# EAGLE design amp (EAGLE 5.07)
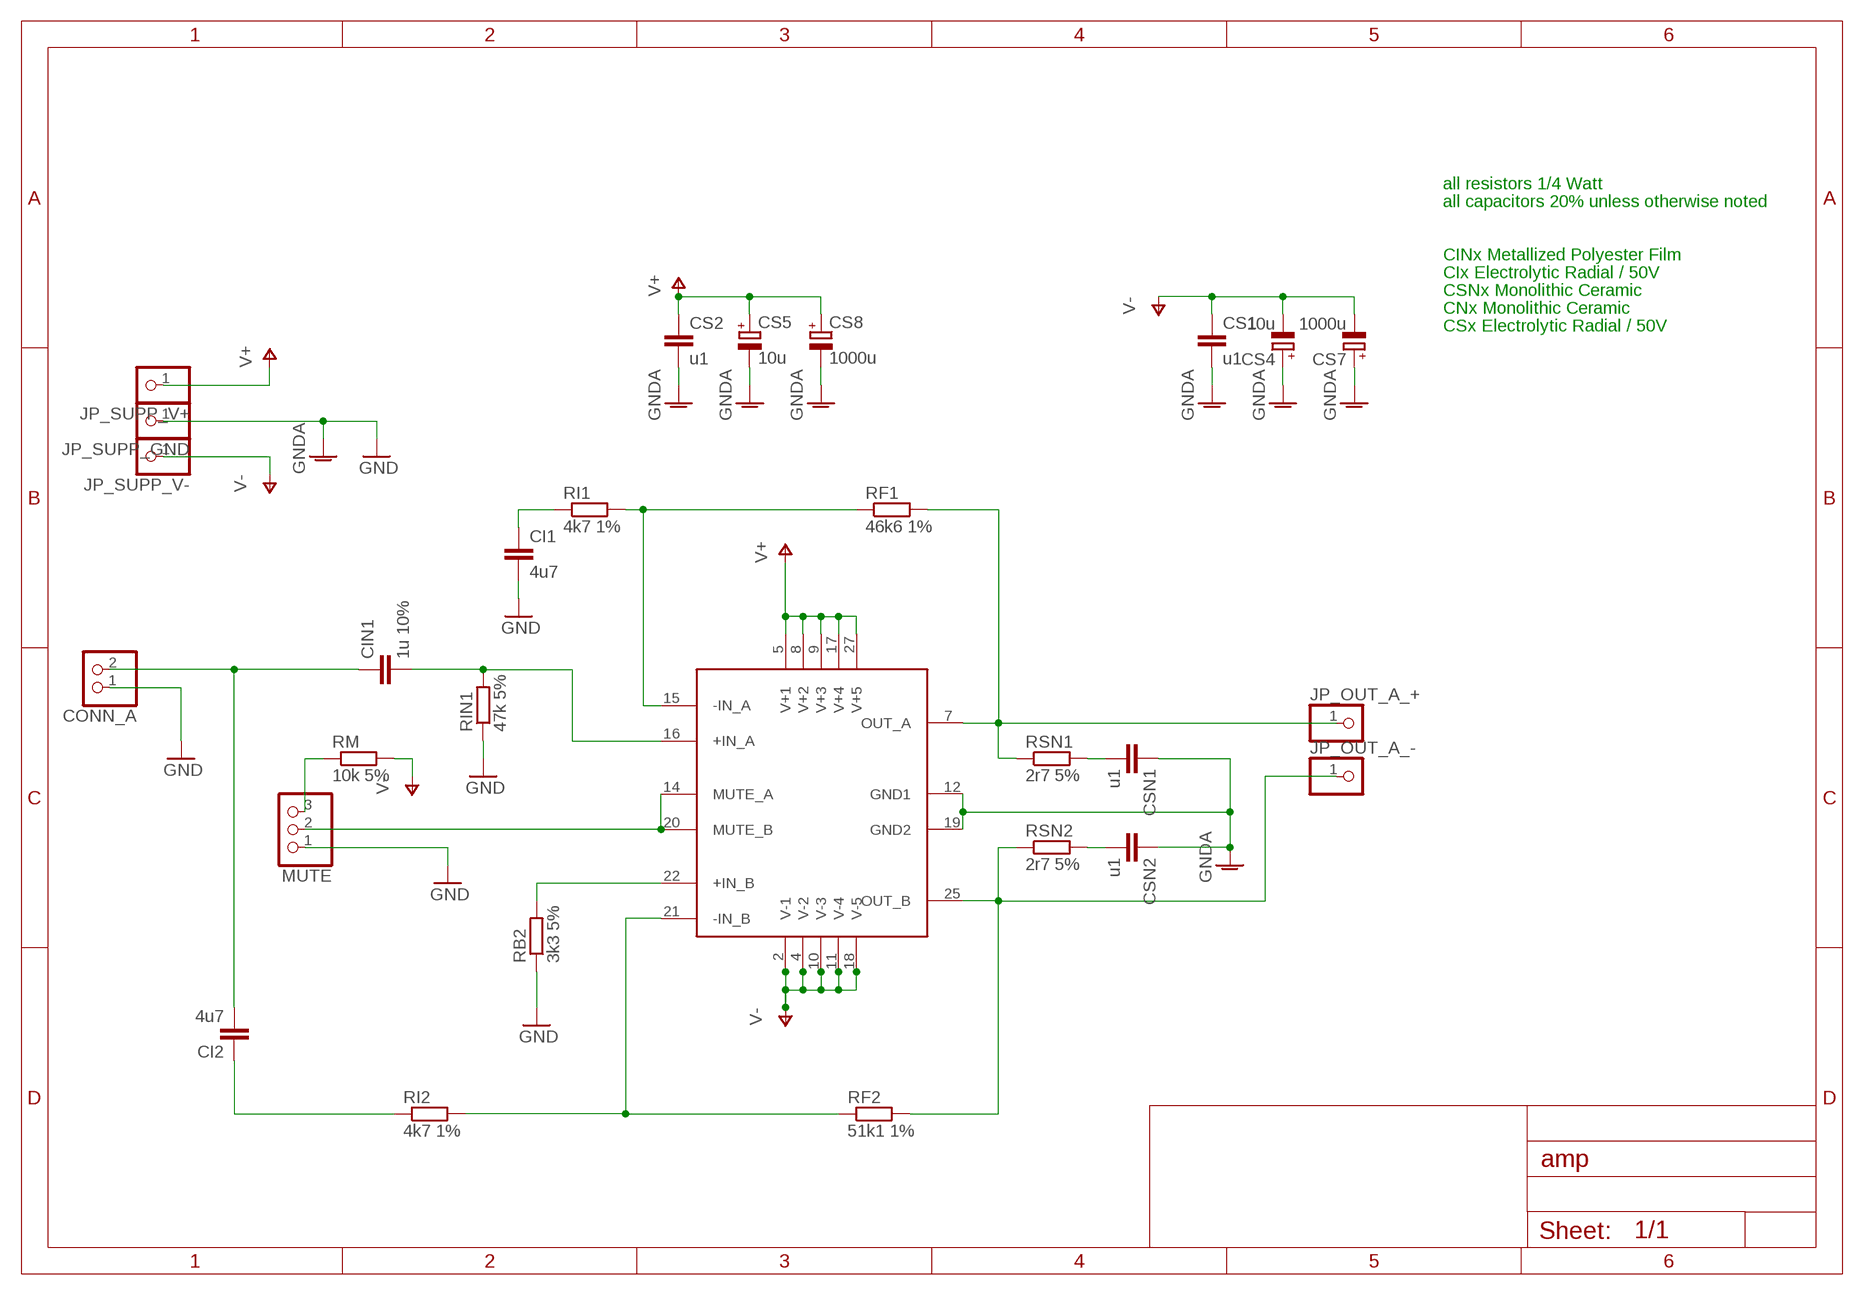
[diagram p0: schematic, sheet 1]

## Parts
CI1  4u7  C-EU050-050X075  [C050-050X075]
CI2  4u7  C-EU050-050X075  [C050-050X075]
CIN1  1u 10%  C-EU050-025X075  [C050-025X075]
CONN_A  PINHD-1X2  [1X02]
CS1  u1  C-EU050-025X075  [C050-025X075]
CS2  u1  C-EU050-025X075  [C050-025X075]
CS4  10u  CPOL-EUE2-5  [E2-5]
CS5  10u  CPOL-EUE2-5  [E2-5]
CS7  1000u  CPOL-EUE7.5-16  [E7,5-16]
CS8  1000u  CPOL-EUE7.5-16  [E7,5-16]
CSN1  u1  C-EU025-030X050  [C025-030X050]
CSN2  u1  C-EU025-030X050  [C025-030X050]
JP_OUT_A_+  PINHD-1X1  [1X01]
JP_OUT_A_-  PINHD-1X1  [1X01]
JP_SUPP_GND  PINHD-1X1  [1X01]
JP_SUPP_V+  PINHD-1X1  [1X01]
JP_SUPP_V-  PINHD-1X1  [1X01]
MUTE  PINHD-1X3  [1X03]
RB2  3k3 5%  R-EU_0204/7  [0204/7]
RF1  46k6 1%  R-EU_0204/5  [0204/5]
RF2  51k1 1%  R-EU_0204/5  [0204/5]
RI1  4k7 1%  R-EU_0204/5  [0204/5]
RI2  4k7 1%  R-EU_0204/5  [0204/5]
RIN1  47k 5%  R-EU_0207/7  [0207/7]
RM  10k 5%  R-EU_0204/5  [0204/5]
RSN1  2r7 5%  R-EU_0204/5  [0204/5]
RSN2  2r7 5%  R-EU_0204/5  [0204/5]
U$1  L4780TA  LM4780TA  [TO-220_27]

## Nets
+INA [audio_in]: CIN1.2 RIN1.2 U$1.16(+IN_A)
+INB [audio_in]: RB2.2 U$1.22(+IN_B)
-INA: RF1.1 RI1.2 U$1.15(-IN_A)
-INB: RF2.1 RI2.2 U$1.21(-IN_B)
GND [power]: CI1.2 CONN_A.1 CS1.2 CS2.2 CS4.+ CS5.- CS7.+ CS8.- CSN1.1 CSN2.1 JP_SUPP_GND.1 MUTE.1 RB2.1 RIN1.1 U$1.12(GND1) U$1.19(GND2) ; supply symbol labelled GNDA
N$4 [power]: MUTE.3 RM.1
N$6 [low_gnd]: CI2.2 CIN1.1 CONN_A.2
N$9: CSN1.2 RSN1.2
N$11: CI2.1 RI2.1
N$14: CSN2.2 RSN2.2
N$17: CI1.1 RI1.1
N_MUTE: MUTE.2 U$1.14(MUTE_A) U$1.20(MUTE_B)
N_OUT_A [audio_out]: JP_OUT_A_+.1 RF1.2 RSN1.1 U$1.7(OUT_A)
N_OUT_B [audio_out]: JP_OUT_A_-.1 RF2.2 RSN2.1 U$1.25(OUT_B)
V+ [power]: CS2.1 CS5.+ CS8.+ JP_SUPP_V+.1 U$1.5(V+1) U$1.8(V+2) U$1.9(V+3) U$1.17(V+4) U$1.27(V+5)
V- [power]: CS1.1 CS4.- CS7.- JP_SUPP_V-.1 RM.2 U$1.2(V-1) U$1.4(V-2) U$1.10(V-3) U$1.11(V-4) U$1.18(V-5)

## Notes on the sheet
- all resistors 1/4 Watt
- all capacitors 20% unless otherwise noted
- CINx Metallized Polyester Film
- CIx Electrolytic Radial / 50V
- CSNx Monolithic Ceramic
- CNx Monolithic Ceramic
- CSx Electrolytic Radial / 50V

## Library data of the parts
CI1 CI2 CIN1 CS1 CS2 CSN1 CSN2 = resistor:C-EU: CAPACITOR, European symbol
CONN_A = pinhead:PINHD-1X2: PIN HEADER
CS4 CS5 CS7 CS8 = resistor:CPOL-EU: POLARIZED CAPACITOR, European symbol
JP_OUT_A_+ JP_OUT_A_- JP_SUPP_GND JP_SUPP_V+ JP_SUPP_V- = pinhead:PINHD-1X1: PIN HEADER
MUTE = pinhead:PINHD-1X3: PIN HEADER
RB2 RF1 RF2 RI1 RI2 RIN1 RM RSN1 RSN2 = resistor:R-EU_: RESISTOR, European symbol
U$1 = mru-lib:LM4780TA: National Semiconductor LM4780 Overture Audio Power Amplifier Series TO220 27 Lead Package

## Net classes
1 power: width 1.778 mm
2 audio_in: width 0.508 mm
3 audio_out: width 1.27 mm

## Board
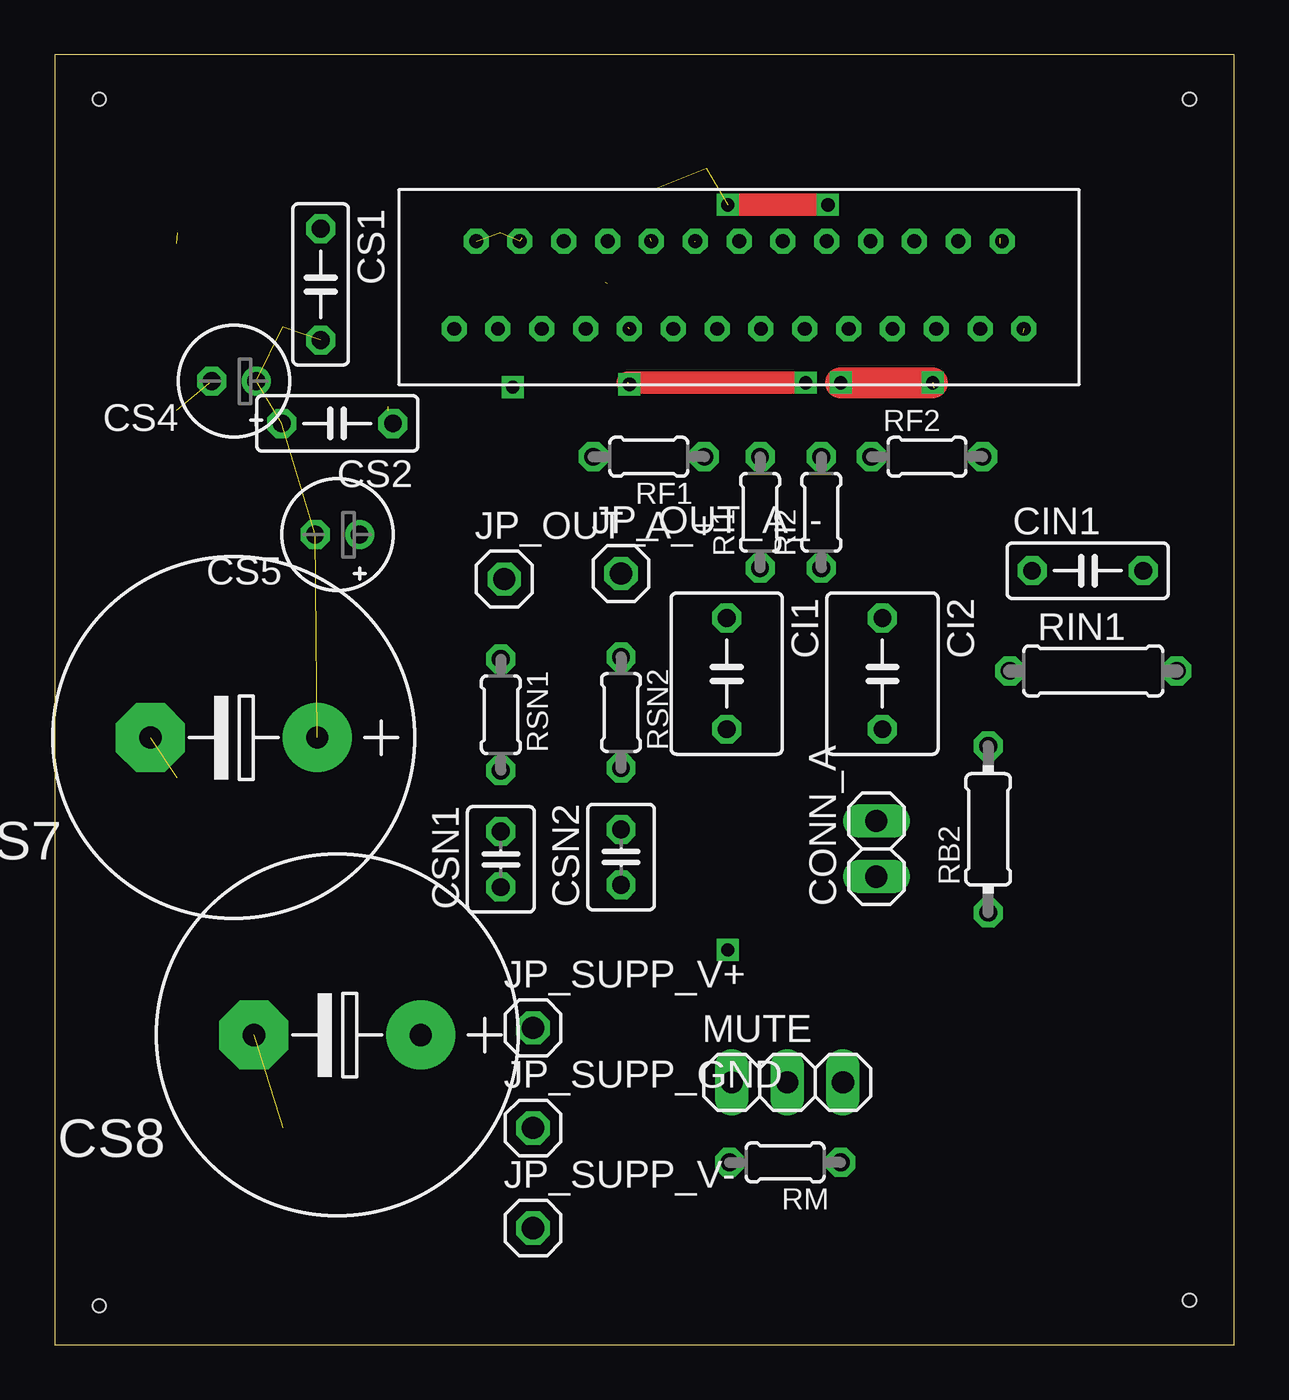
[diagram p1: board, top side]
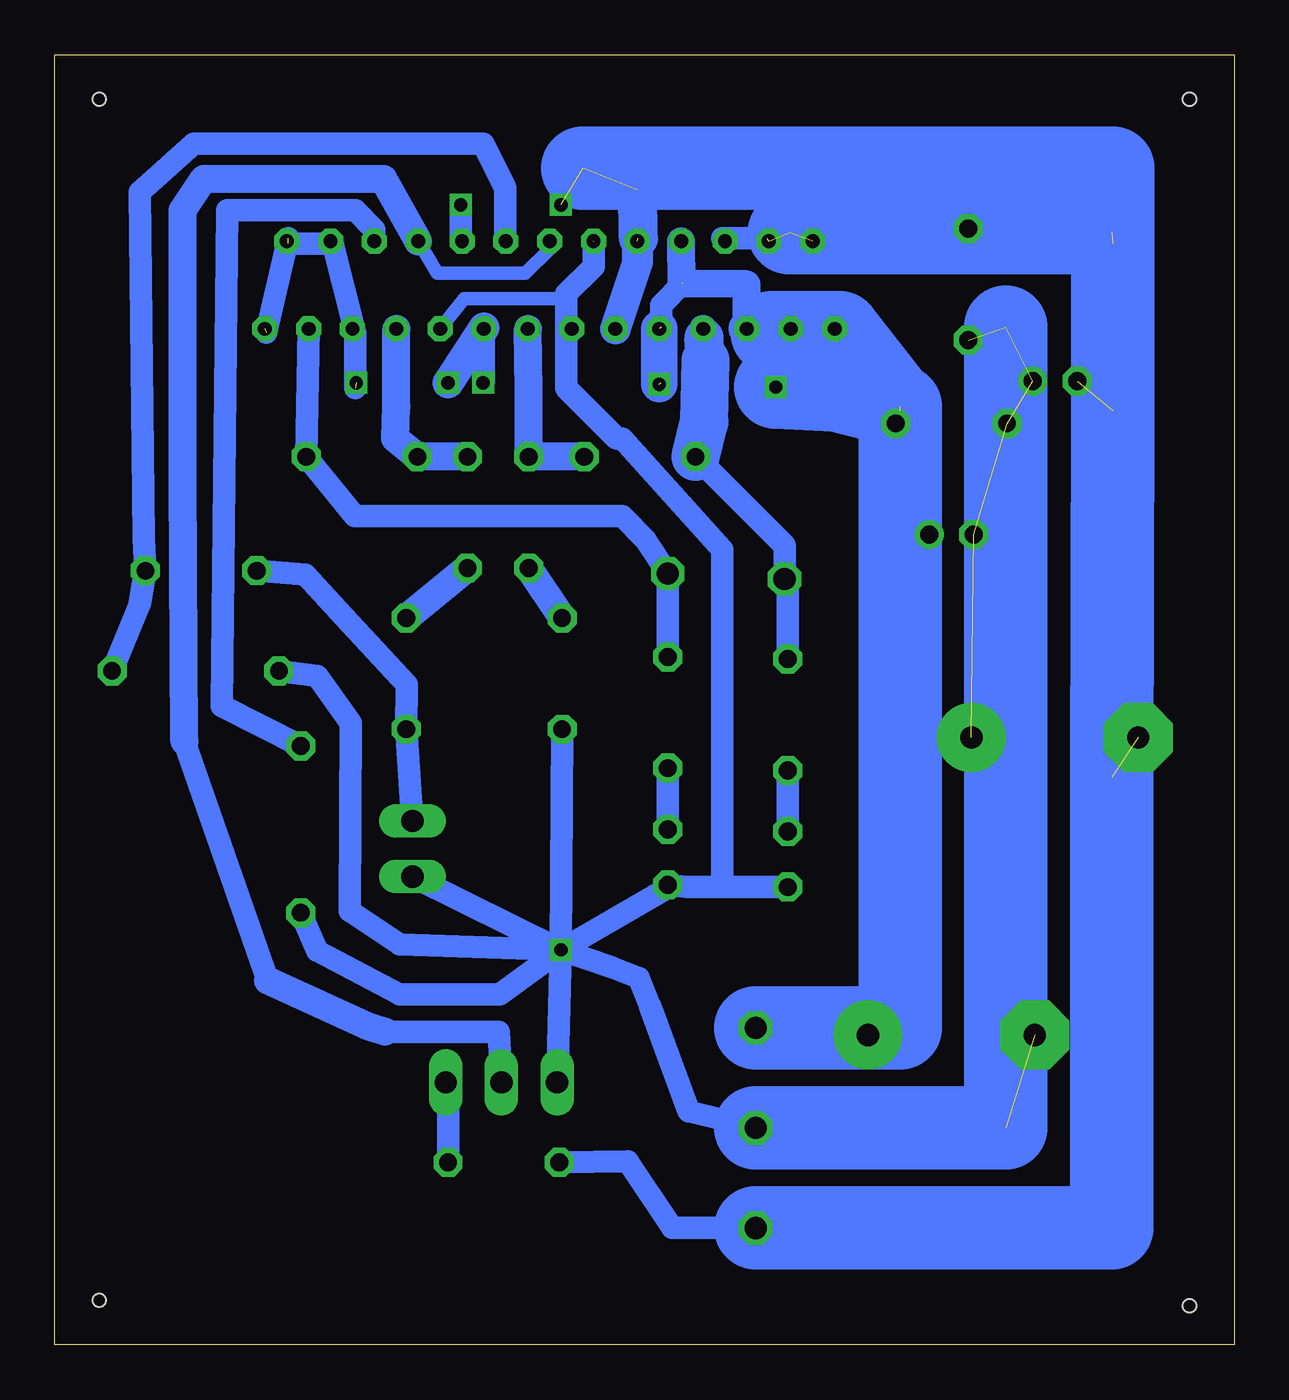
[diagram p2: board, bottom side, seen from below]

Size 53.85 x 58.93 mm. Coordinates in mm from the lower left corner, seen from the top.
Outline: 0,0 53.85,0 53.85,58.93 0,58.93 0,0
Copper layers (1*16): Top 0.035mm / dielectric 1.5mm / Bottom 0.035mm
Design rules "default": minimum track width 10mil, minimum drill 24mil, track to track 8mil, track to pad 8mil, pad to pad 8mil, via to via 8mil, smd to smd 8mil, copper to edge 40mil, drill to drill 8mil, minimum pad ring 10mil, minimum via ring 8mil, stop-mask expansion 4mil, vias tented up to drill 0mil, thermal gap 10mil
Holes 0.6 mm at 2.03,1.78 2.03,56.9 51.82,56.9 51.82,2.03

### Footprints (pad centres in the part's own frame; a part is rotated, then mirrored left to right if it is on the bottom)
C050-050X075 = drill 0.813 octagon: 1 -2.54,0; 2 2.54,0
C050-025X075 = drill 0.813 octagon: 1 -2.54,0; 2 2.54,0
1X02 = drill 1.016 long: 1 -1.27,0; 2 1.27,0
E2-5 = drill 0.813 pad 1.27 round: + -1.016,0 | drill 0.813 pad 1.27 octagon: - 1.016,0
E7,5-16 = drill 1.016 pad 3.15 round: + -3.81,0 | drill 1.016 pad 3.15 octagon: - 3.81,0
C025-030X050 = drill 0.813 octagon: 1 -1.27,0; 2 1.27,0
1X01 = drill 1.016 octagon: 1 0,0
1X03 = drill 1.016 long: 1 -2.54,0; 2 0,0; 3 2.54,0
0204/7 = drill 0.813 octagon: 1 -3.81,0; 2 3.81,0
0204/5 = drill 0.813 octagon: 1 -2.54,0; 2 2.54,0
0207/7 = drill 0.813 octagon: 1 -3.81,0; 2 3.81,0
TO-220_27 = drill 0.635 octagon: 1 0,0; 2 1.001,4.003; 3 2.002,0; 4 3.002,4.003; 5 4.003,0; 6 5.004,4.003; 7 6.005,0; 8 7.005,4.003; 9 8.006,0; 10 9.007,4.003; 11 10.008,0; 12 11.008,4.003; 13 12.009,0; 14 13.01,4.003; 15 14.011,0; 16 15.011,4.003; 17 16.012,0; 18 17.013,4.003; 19 18.014,0; 20 19.014,4.003; 21 20.015,0; 22 21.016,4.003; 23 22.017,0; 24 23.017,4.003; 25 24.018,0; 26 25.019,4.003; 27 26.015,0

### Placement (x,y rotation side)
CI1  30.68,30.66 270 top
CI2  37.8,30.66 270 top
CIN1  47.17,35.36 0 top
CONN_A  37.52,22.66 90 top
CS1  12.14,48.44 270 top
CS2  12.9,42.09 180 top
CS4  8.18,44.02 180 top
CS5  12.9,37.01 180 top
CS7  8.18,27.74 180 top
CS8  12.9,14.15 180 top
CSN1  20.37,22.17 90 top
CSN2  25.86,22.28 90 top
JP_OUT_A_+  20.52,34.98 0 top
JP_OUT_A_-  25.86,35.23 0 top
JP_SUPP_GND  21.84,9.91 0 top
JP_SUPP_V+  21.84,14.48 0 top
JP_SUPP_V-  21.84,5.33 0 top
MUTE  33.45,11.99 0 top
RB2  42.62,23.55 90 top
RF1  27.13,40.56 180 top
RF2  39.83,40.56 0 top
RI1  32.21,38.02 90 top
RI2  35,38.02 90 top
RIN1  47.42,30.78 0 top
RM  33.35,8.33 180 top
RSN1  20.37,28.78 270 top
RSN2  25.86,28.88 270 top
U$1  18.24,46.41 0 top

### Tracks (layer width: path | path; a pad name or v marks a point on that pad's centre or on a via)
+INA
  Bottom 1.016: RIN1.2 49.96,33.83 CIN1.2 49.78,36.83 49.96,52.65 47.5,54.86 34.29,54.86 33.27,52.83 33.27,50.43 U$1.16
+INB
  Bottom 1.016: U$1.22 39.25,50.94 40.13,51.82 45.97,51.82 46.23,29.18 RB2.2
-INA
  Bottom 1.27: RF1.1 RI1.2 32.21,43.57 U$1.15
-INB
  Bottom 1.27: U$1.21 38.25,42.88 38.3,41.4 RF2.1 RI2.2
GND  (via drill 0.6)  (7 unrouted)
  Bottom 0.61: U$1.19 35.16,47.78 30.81,47.78 29.23,49.3 29.23,50.39
  Bottom 1.016: v30.73,18.03 MUTE.1 | v30.73,18.03 CONN_A.1 | v30.73,18.03 CI1.2 | v30.73,18.03 38.1,18.29 40.39,19.81 40.34,28.4 41.86,30.56 RIN1.1 | RB2.1 41.86,17.98 38.1,16 33.53,16 v30.73,18.03 | 23.37,20.9 24.99,20.9 CSN2.1 25.86,20.88 v30.73,18.03 | 23.37,20.9 CSN1.1 | 29.23,50.39 29.23,49.25 30.48,48.01 30.48,43.69 28.19,41.4 27.94,41.4 23.37,36.32 23.37,20.9 | JP_SUPP_GND.1 24.89,10.67 26.67,15.49 27.18,16.76 28.45,17.27 v30.73,18.03
  Bottom 3.81: JP_SUPP_GND.1 10.41,9.91 10.41,46.48
N$4
  Bottom 1.016: MUTE.3 35.89,11.89 RM.1
N$6
  Bottom 1.016: CONN_A.2 CI2.2 37.77,30.15 40.64,33.27 42.42,35.18 CIN1.1
N$9
  Bottom 1.016: CSN1.2 RSN1.2
N$11
  Bottom 1.27: RI2.1 CI2.1
N$14
  Bottom 1.016: CSN2.2 RSN2.2
N$17
  Bottom 1.27: RI1.1 CI1.1
N_MUTE
  Bottom 0.61: U$1.14 31.24,50.04 32.36,48.95 36.37,48.95 U$1.20
  Bottom 1.016: MUTE.2 33.58,14.3 38.76,14.3 | 44.12,16.64 47.93,27.56
  Bottom 1.27: 38.76,14.3 39.37,14.48 44.12,16.64 | 47.93,27.56 48.01,39.62 48.01,51.82 47.04,53.26 38.84,53.26 U$1.20
N_OUT_A
  Bottom 1.016: RF1.2 20.52,36.5 JP_OUT_A_+.1 20.37,34.82 RSN1.1
  Bottom 1.27: 24.21,46.02 U$1.7
  Bottom 1.778: 24.13,44.96 24.21,46.02
  Bottom 2.184: 24.13,44.96 24.18,42.16 RF1.2
N_OUT_B
  Bottom 1.016: U$1.25 RF2.2 40.16,37.85 27.94,37.85 26.87,36.78 JP_OUT_A_-.1 RSN2.1
V+  (via drill 0.6)  (7 unrouted)
  Top 1.016: 26.16,43.94 v34.29,43.94
  Top 1.422: v35.89,43.94 v40.09,43.94
  Bottom 0.406: 15.24,35.05 CS5.+ | CS8.+ 15.24,14.48
  Bottom 0.61: U$1.17 34.25,46.44
  Bottom 1.016: 26.16,46.48 26.16,47.5 25.15,48.51 | v34.29,43.94 34.25,43.98 U$1.17 | 43.18,50.29 41.15,50.29 40.13,46.23 40.13,43.69 | 44.2,46.23 43.18,50.55
  Bottom 1.27: U$1.5 22.25,48.44 25.22,48.46 U$1.8
  Bottom 1.422: 34.25,46.44 v35.89,43.94
  Bottom 1.676: 15.24,42.85 CS2.1 | v20.92,43.74 U$1.5 | v26.24,43.87 U$1.9
  Bottom 3.81: v20.92,43.74 18.18,43.61 15.24,42.85 15.24,35.05 15.24,14.48 JP_SUPP_V+.1 | 15.24,42.67 18.03,46.23 21.08,46.23
V-  (via drill 0.6)  (9 unrouted)
  Top 1.016: v35.31,52.07 v30.73,52.07
  Bottom 0.406: 5.54,50.29 7.29,50.47
  Bottom 1.016: RM.2 27.69,8.38 25.65,5.33 JP_SUPP_V-.1 | U$1.18 35.31,50.47 v35.31,52.07 | 21.34,50.55 23.37,50.55
  Bottom 1.422: U$1.11 27.24,49.44 U$1.10
  Bottom 1.778: 27.2,50.55 27.23,52.73
  Bottom 2.54: 7.29,50.47 CS1.1
  Bottom 3.81: 29.74,53.75 5.54,53.75 5.54,50.29 5.54,47.3 5.55,42.67 5.58,25.91 5.59,5.33 JP_SUPP_V-.1 | 5.59,50.8 20.32,50.8